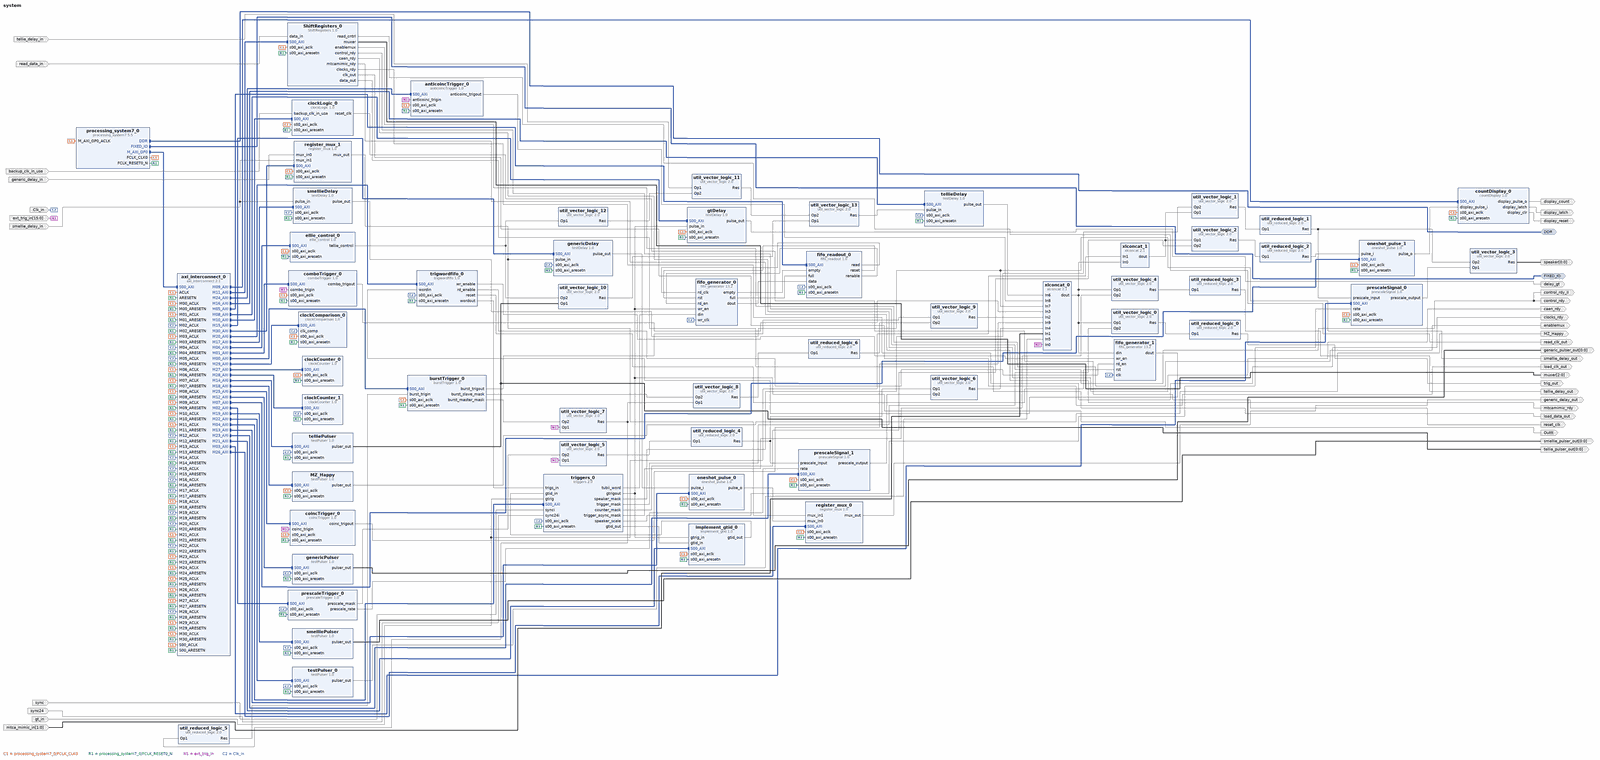
[diagram p0: block diagram of the top level, whole]
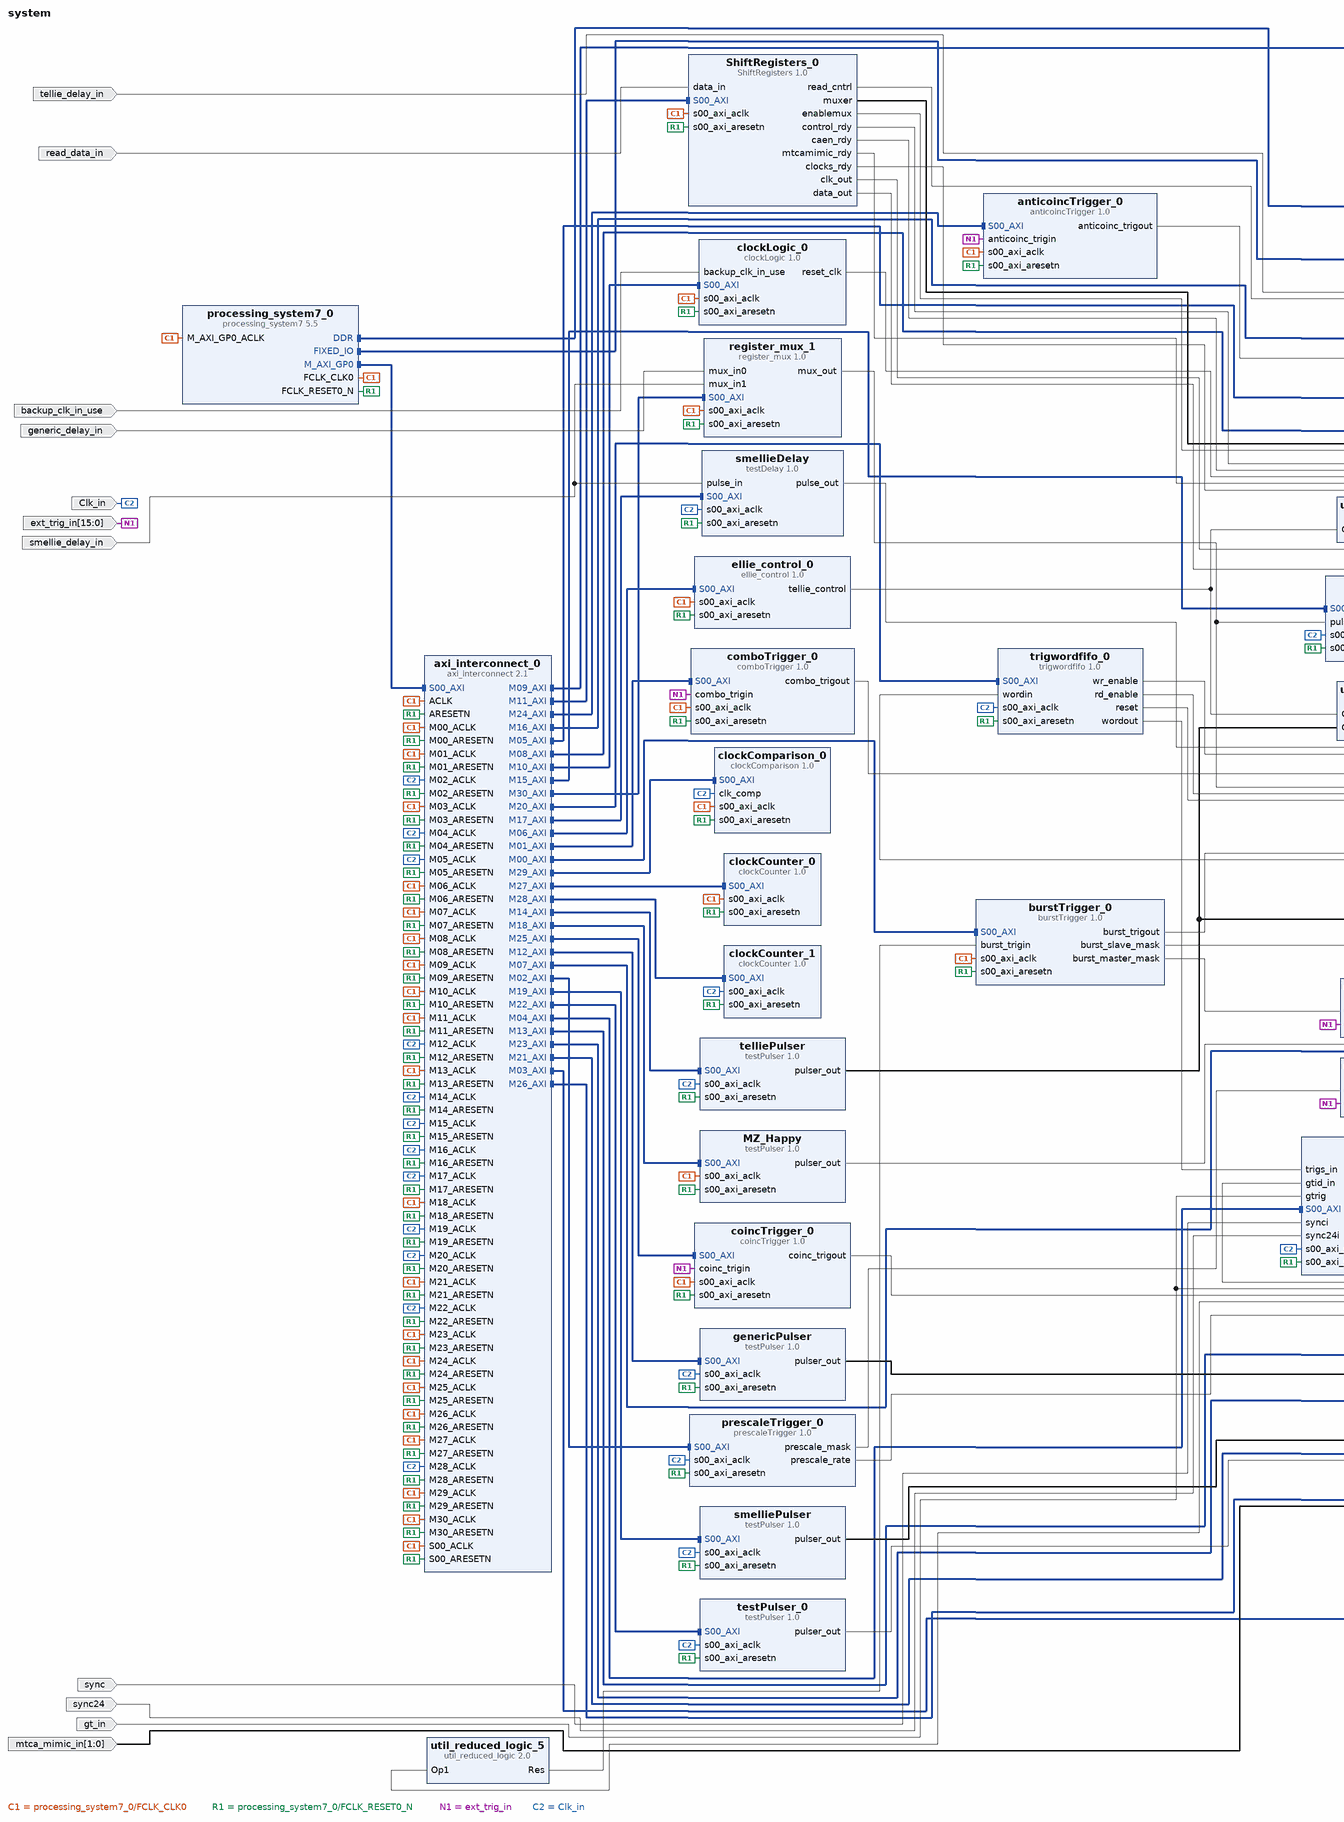
[diagram p1: block diagram of the top level, left part]
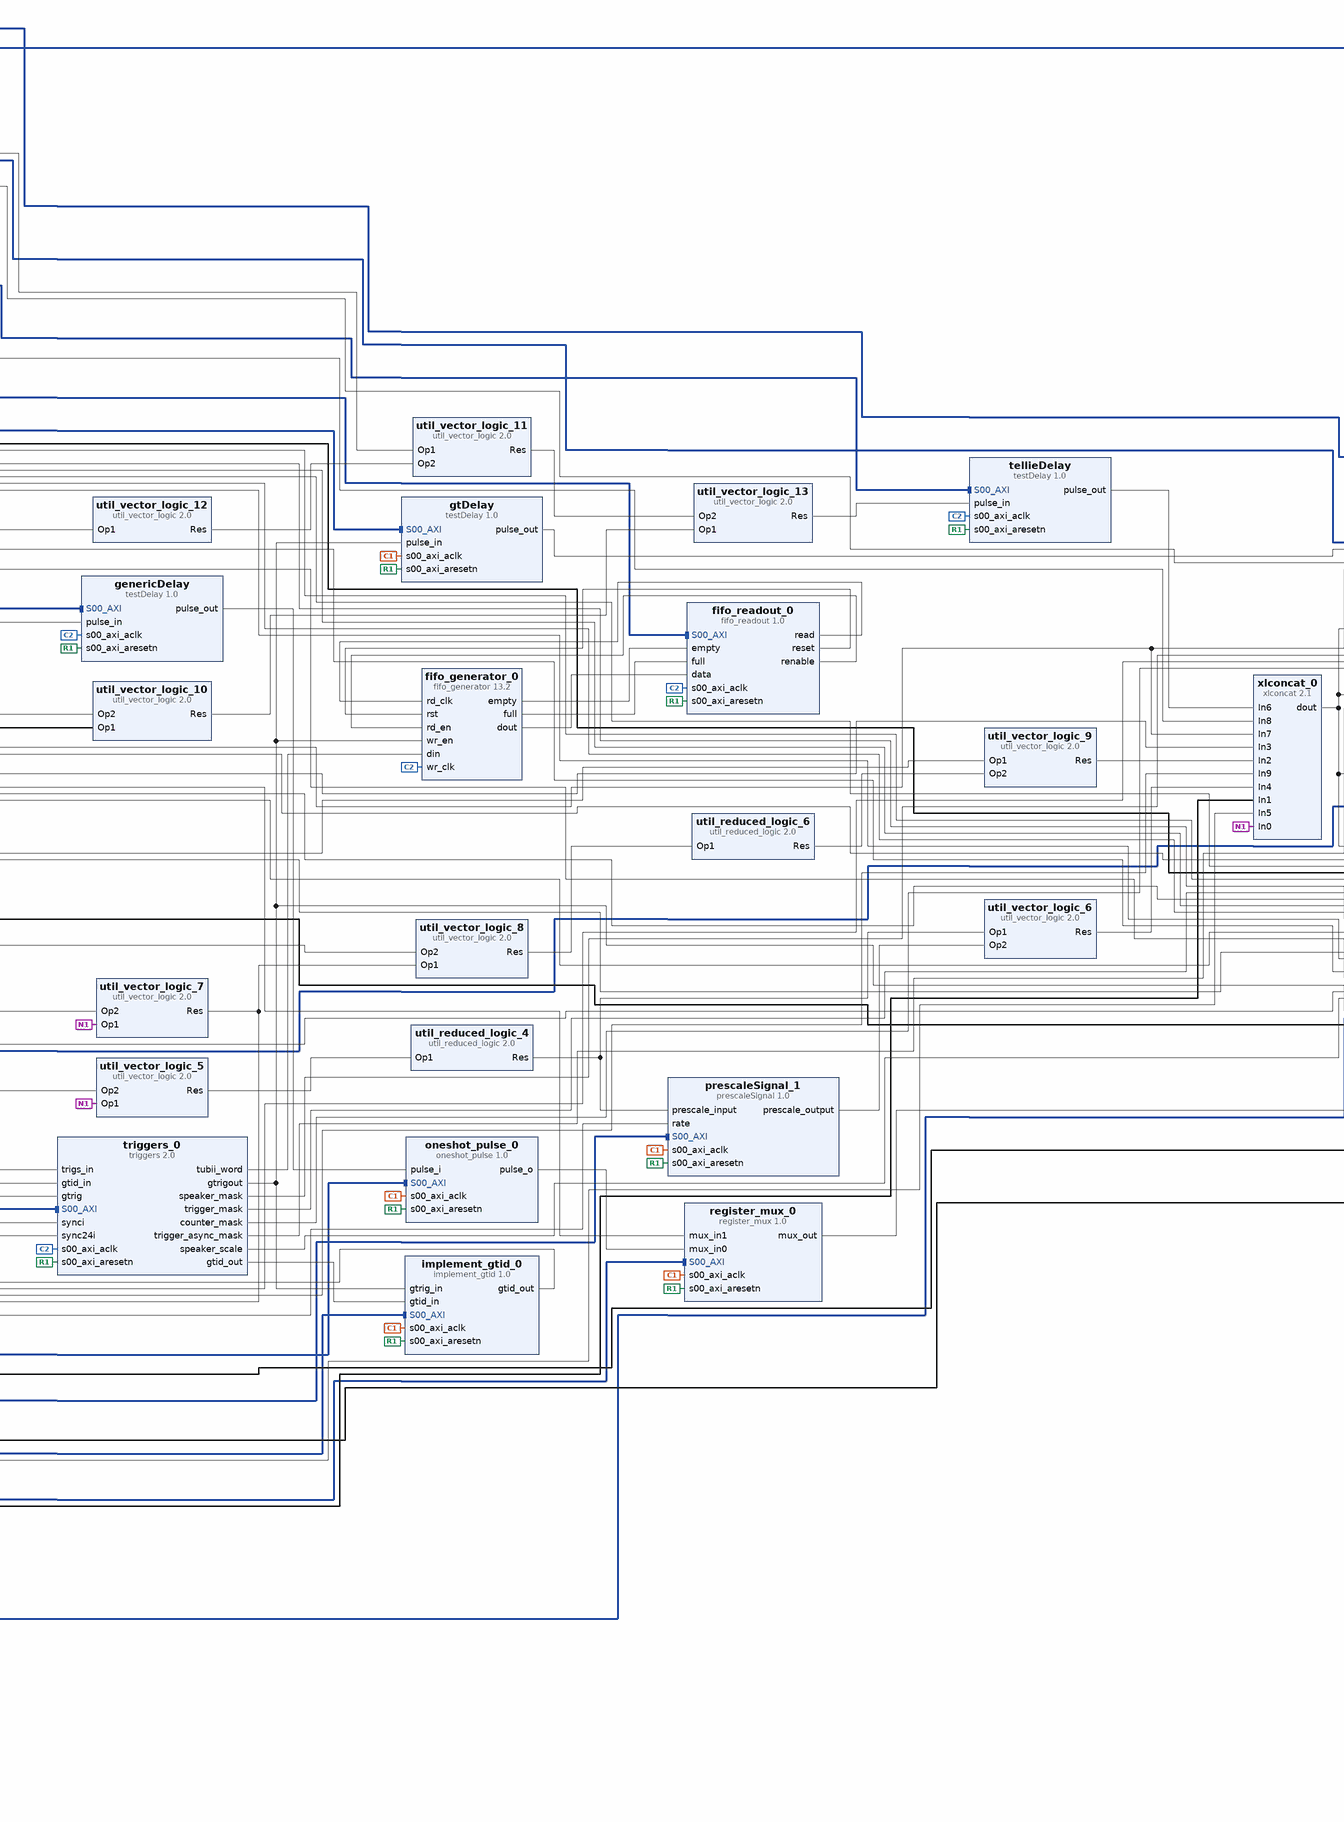
[diagram p2: block diagram of the top level, centre part]
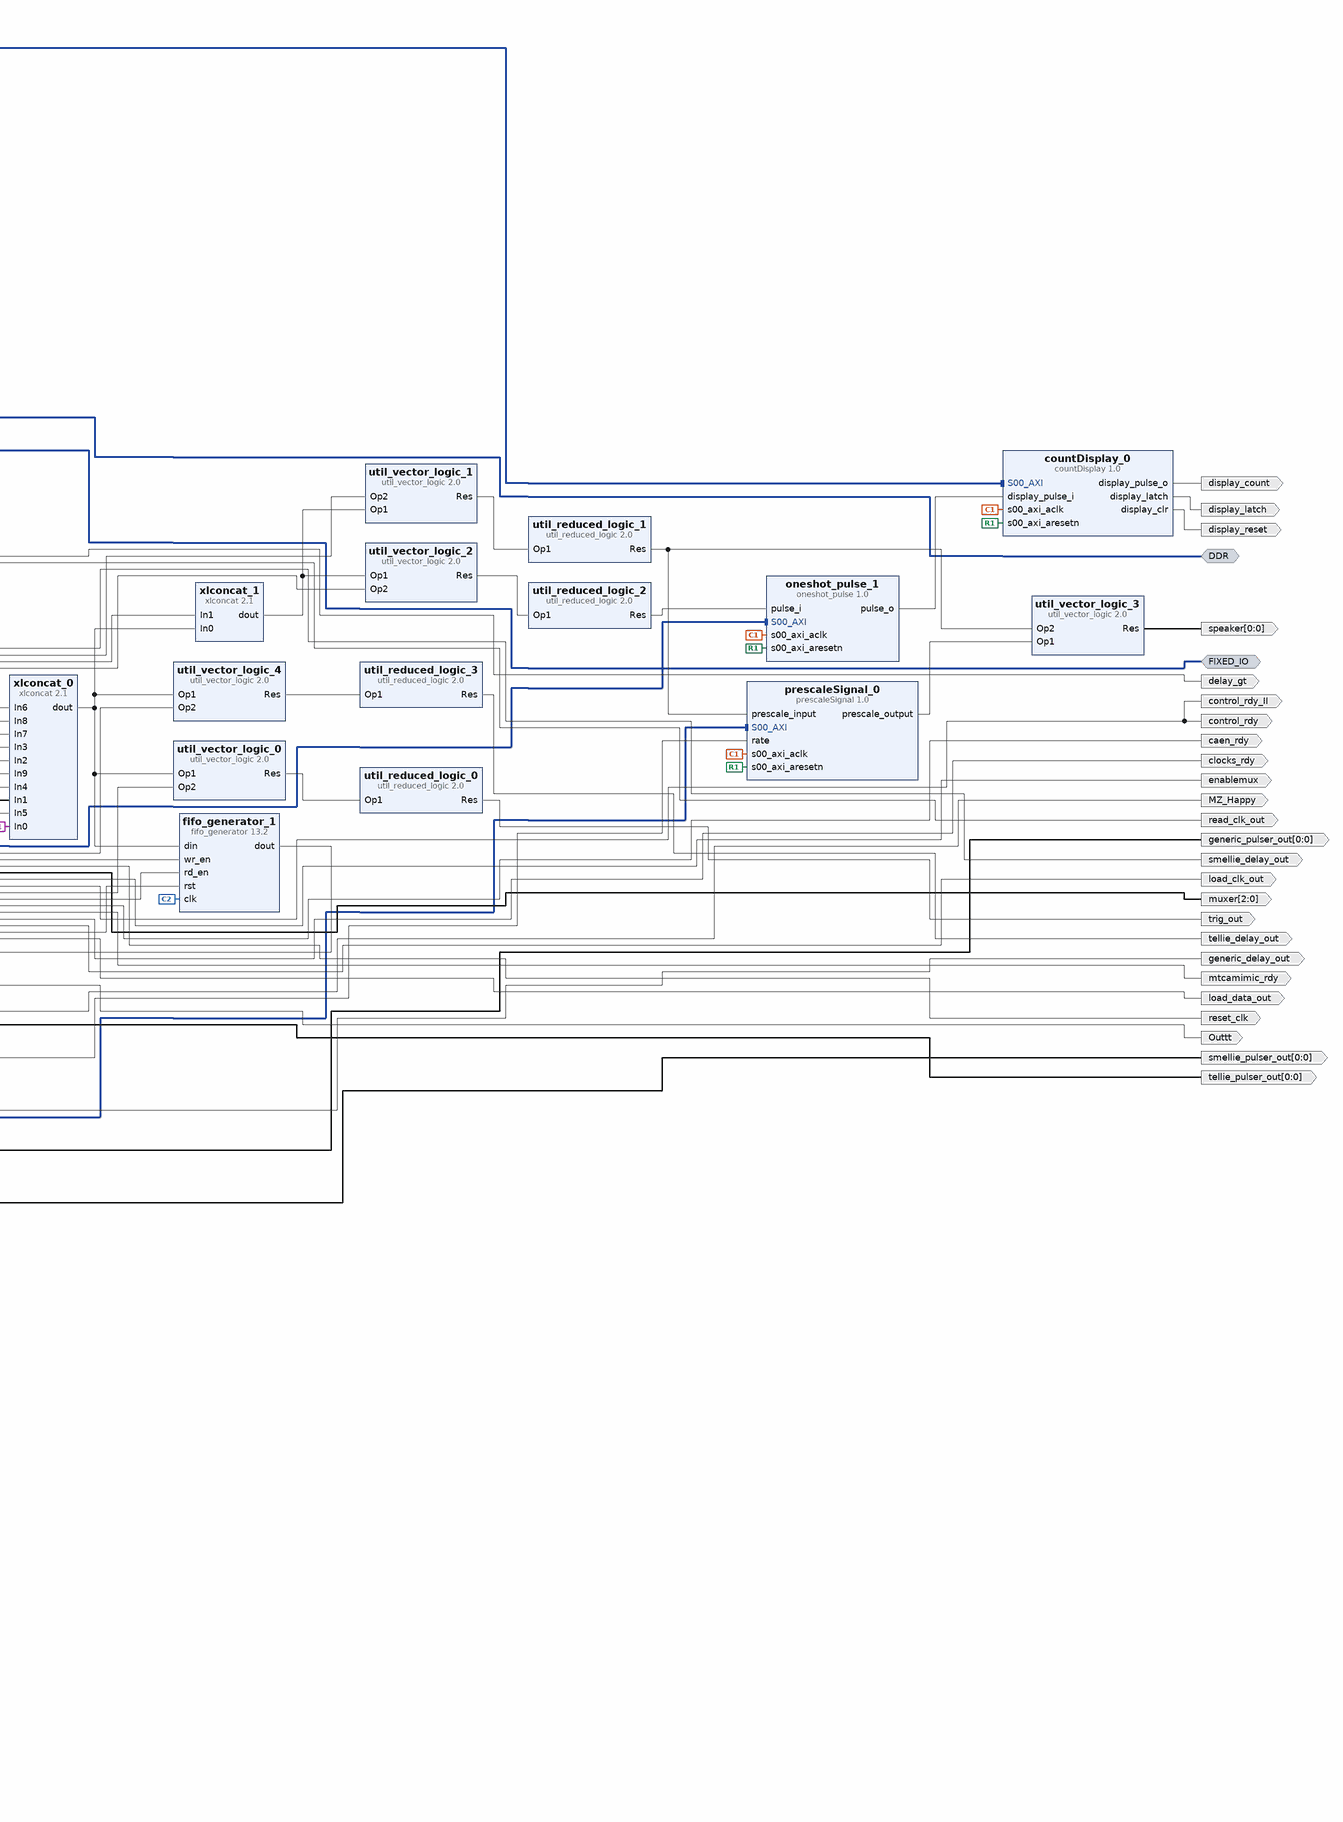
[diagram p3: block diagram of the top level, right part]
# Vivado block design system, xc7z020clg400-1, Vivado 2018.2
create_bd_design system

create_bd_intf_port -mode Master -vlnv xilinx.com:interface:ddrx_rtl:1.0 DDR
create_bd_intf_port -mode Master -vlnv xilinx.com:display_processing_system7:fixedio_rtl:1.0 FIXED_IO
create_bd_port -dir O trig_out
create_bd_port -dir O display_reset
create_bd_port -dir O display_latch
create_bd_port -dir O display_count
create_bd_port -dir I generic_delay_in
create_bd_port -dir I tellie_delay_in
create_bd_port -dir O smellie_delay_out
create_bd_port -dir I smellie_delay_in
create_bd_port -dir I sync
create_bd_port -dir I sync24
create_bd_port -dir I gt_in
create_bd_port -dir O read_clk_out
create_bd_port -dir I read_data_in
create_bd_port -dir O MZ_Happy
create_bd_port -dir O delay_gt
create_bd_port -dir I -from 1 -to 0 mtca_mimic_in
create_bd_port -dir I backup_clk_in_use
create_bd_port -dir O reset_clk
create_bd_port -dir I -from 15 -to 0 ext_trig_in
create_bd_port -dir O -from 2 -to 0 muxer
create_bd_port -dir O enablemux
create_bd_port -dir O control_rdy_II
create_bd_port -dir O control_rdy
create_bd_port -dir O caen_rdy
create_bd_port -dir O mtcamimic_rdy
create_bd_port -dir O clocks_rdy
create_bd_port -dir O load_clk_out
create_bd_port -dir O load_data_out
create_bd_port -dir O -from 0 -to 0 generic_pulser_out
create_bd_port -dir O -from 0 -to 0 tellie_pulser_out
create_bd_port -dir O -from 0 -to 0 smellie_pulser_out
create_bd_port -dir I -type clk Clk_in
set_property -dict {CONFIG.FREQ_HZ 100000000} [get_bd_ports Clk_in]
create_bd_port -dir O Outtt
create_bd_port -dir O -from 0 -to 0 speaker
create_bd_port -dir O tellie_delay_out
create_bd_port -dir O generic_delay_out

create_bd_cell -type ip -vlnv xilinx.com:user:countDisplay:1.0 countDisplay_0
create_bd_cell -type ip -vlnv xilinx.com:user:comboTrigger:1.0 comboTrigger_0
create_bd_cell -type ip -vlnv xilinx.com:user:prescaleTrigger:1.0 prescaleTrigger_0
create_bd_cell -type ip -vlnv xilinx.com:user:clockLogic:1.0 clockLogic_0
create_bd_cell -type ip -vlnv xilinx.com:user:ellie_control:1.0 ellie_control_0
create_bd_cell -type ip -vlnv xilinx.com:ip:axi_interconnect:2.1 axi_interconnect_0
set_property -dict {CONFIG.NUM_MI 31 CONFIG.SYNCHRONIZATION_STAGES 2} [get_bd_cells axi_interconnect_0]
create_bd_cell -type ip -vlnv xilinx.com:ip:fifo_generator:13.2 fifo_generator_0
set_property -dict [list \
  CONFIG.Fifo_Implementation Independent_Clocks_Block_RAM \
  CONFIG.Performance_Options Standard_FIFO \
  CONFIG.Input_Data_Width 50 \
  CONFIG.Input_Depth 65536 \
  CONFIG.Output_Data_Width 50 \
  CONFIG.Full_Flags_Reset_Value 1 \
] [get_bd_cells fifo_generator_0]
create_bd_cell -type ip -vlnv xilinx.com:ip:fifo_generator:13.2 fifo_generator_1
set_property -dict [list \
  CONFIG.Input_Data_Width 26 \
  CONFIG.Input_Depth 32768 \
  CONFIG.Output_Data_Width 26 \
  CONFIG.Reset_Type Asynchronous_Reset \
  CONFIG.Full_Flags_Reset_Value 1 \
] [get_bd_cells fifo_generator_1]
create_bd_cell -type ip -vlnv xilinx.com:ip:processing_system7:5.5 processing_system7_0
set_property -dict [list \
  CONFIG.PCW_UIPARAM_DDR_FREQ_MHZ 533.333333 \
  CONFIG.PCW_APU_PERIPHERAL_FREQMHZ 666.666666 \
  CONFIG.PCW_SDIO_PERIPHERAL_FREQMHZ 50 \
  CONFIG.PCW_UART_PERIPHERAL_FREQMHZ 100 \
  CONFIG.PCW_FPGA0_PERIPHERAL_FREQMHZ 100 \
  CONFIG.PCW_FPGA1_PERIPHERAL_FREQMHZ 50 \
  CONFIG.PCW_M_AXI_GP0_FREQMHZ 100 \
  CONFIG.PCW_GP0_EN_MODIFIABLE_TXN 0 \
  CONFIG.PCW_GP1_EN_MODIFIABLE_TXN 0 \
  CONFIG.PCW_PERIPHERAL_BOARD_PRESET microzed \
  CONFIG.PCW_PRESET_BANK1_VOLTAGE {LVCMOS 3.3V} \
  CONFIG.PCW_UIPARAM_DDR_PARTNO {MT41J128M8 JP-125} \
  CONFIG.PCW_QSPI_PERIPHERAL_ENABLE 1 \
  CONFIG.PCW_QSPI_QSPI_IO {MIO 1 .. 6} \
  CONFIG.PCW_QSPI_GRP_SINGLE_SS_ENABLE 1 \
  CONFIG.PCW_QSPI_GRP_SINGLE_SS_IO {MIO 1 .. 6} \
  CONFIG.PCW_SINGLE_QSPI_DATA_MODE x4 \
  CONFIG.PCW_ENET0_PERIPHERAL_ENABLE 1 \
  CONFIG.PCW_ENET0_ENET0_IO {MIO 16 .. 27} \
  CONFIG.PCW_ENET0_GRP_MDIO_ENABLE 0 \
  CONFIG.PCW_ENET_RESET_ENABLE 1 \
  CONFIG.PCW_ENET_RESET_SELECT {Share reset pin} \
  CONFIG.PCW_ENET0_RESET_ENABLE 0 \
  CONFIG.PCW_SD0_PERIPHERAL_ENABLE 1 \
  CONFIG.PCW_SD0_SD0_IO {MIO 40 .. 45} \
  CONFIG.PCW_SD0_GRP_CD_ENABLE 0 \
  CONFIG.PCW_SD0_GRP_WP_ENABLE 0 \
  CONFIG.PCW_UART1_PERIPHERAL_ENABLE 1 \
  CONFIG.PCW_UART1_UART1_IO {MIO 48 .. 49} \
  CONFIG.PCW_TRACE_INTERNAL_WIDTH 32 \
  CONFIG.PCW_USB0_PERIPHERAL_ENABLE 1 \
  CONFIG.PCW_USB0_USB0_IO {MIO 28 .. 39} \
  CONFIG.PCW_USB_RESET_ENABLE 1 \
  CONFIG.PCW_USB_RESET_SELECT {Share reset pin} \
  CONFIG.PCW_USB0_RESET_ENABLE 0 \
  CONFIG.PCW_I2C_RESET_ENABLE 1 \
  CONFIG.PCW_GPIO_MIO_GPIO_ENABLE 1 \
  CONFIG.PCW_GPIO_MIO_GPIO_IO MIO \
] [get_bd_cells processing_system7_0]
# 478 more settings of processing_system7_0 are not shown: defaults, MIO pin electricals, DDR timing, and values the tool derives
create_bd_cell -type ip -vlnv xilinx.com:ip:util_reduced_logic:2.0 util_reduced_logic_0
set_property -dict {CONFIG.C_SIZE 26 CONFIG.C_OPERATION or} [get_bd_cells util_reduced_logic_0]
create_bd_cell -type ip -vlnv xilinx.com:ip:util_reduced_logic:2.0 util_reduced_logic_1
set_property -dict {CONFIG.C_SIZE 27 CONFIG.C_OPERATION or} [get_bd_cells util_reduced_logic_1]
create_bd_cell -type ip -vlnv xilinx.com:ip:util_reduced_logic:2.0 util_reduced_logic_2
set_property -dict {CONFIG.C_SIZE 27 CONFIG.C_OPERATION or} [get_bd_cells util_reduced_logic_2]
create_bd_cell -type ip -vlnv xilinx.com:ip:util_reduced_logic:2.0 util_reduced_logic_3
set_property -dict {CONFIG.C_SIZE 26 CONFIG.C_OPERATION or} [get_bd_cells util_reduced_logic_3]
create_bd_cell -type ip -vlnv xilinx.com:ip:util_reduced_logic:2.0 util_reduced_logic_4
set_property -dict {CONFIG.C_SIZE 16 CONFIG.C_OPERATION or} [get_bd_cells util_reduced_logic_4]
create_bd_cell -type ip -vlnv xilinx.com:ip:util_reduced_logic:2.0 util_reduced_logic_5
set_property -dict {CONFIG.C_SIZE 16 CONFIG.C_OPERATION or} [get_bd_cells util_reduced_logic_5]
create_bd_cell -type ip -vlnv xilinx.com:ip:util_reduced_logic:2.0 util_reduced_logic_6
set_property -dict {CONFIG.C_SIZE 16 CONFIG.C_OPERATION or} [get_bd_cells util_reduced_logic_6]
create_bd_cell -type ip -vlnv xilinx.com:ip:util_vector_logic:2.0 util_vector_logic_0
set_property -dict {CONFIG.C_SIZE 26} [get_bd_cells util_vector_logic_0]
create_bd_cell -type ip -vlnv xilinx.com:ip:util_vector_logic:2.0 util_vector_logic_10
set_property -dict {CONFIG.C_SIZE 1} [get_bd_cells util_vector_logic_10]
create_bd_cell -type ip -vlnv xilinx.com:ip:util_vector_logic:2.0 util_vector_logic_11
set_property -dict {CONFIG.C_SIZE 1 CONFIG.C_OPERATION and} [get_bd_cells util_vector_logic_11]
create_bd_cell -type ip -vlnv xilinx.com:ip:util_vector_logic:2.0 util_vector_logic_12
set_property -dict {CONFIG.C_SIZE 1 CONFIG.C_OPERATION not} [get_bd_cells util_vector_logic_12]
create_bd_cell -type ip -vlnv xilinx.com:ip:util_vector_logic:2.0 util_vector_logic_13
set_property -dict {CONFIG.C_SIZE 1 CONFIG.C_OPERATION or} [get_bd_cells util_vector_logic_13]
create_bd_cell -type ip -vlnv xilinx.com:ip:util_vector_logic:2.0 util_vector_logic_1
set_property -dict {CONFIG.C_SIZE 27} [get_bd_cells util_vector_logic_1]
create_bd_cell -type ip -vlnv xilinx.com:ip:util_vector_logic:2.0 util_vector_logic_2
set_property -dict {CONFIG.C_SIZE 27} [get_bd_cells util_vector_logic_2]
create_bd_cell -type ip -vlnv xilinx.com:ip:util_vector_logic:2.0 util_vector_logic_3
set_property -dict {CONFIG.C_SIZE 1} [get_bd_cells util_vector_logic_3]
create_bd_cell -type ip -vlnv xilinx.com:ip:util_vector_logic:2.0 util_vector_logic_4
set_property -dict {CONFIG.C_SIZE 26} [get_bd_cells util_vector_logic_4]
create_bd_cell -type ip -vlnv xilinx.com:ip:util_vector_logic:2.0 util_vector_logic_5
set_property -dict {CONFIG.C_SIZE 16} [get_bd_cells util_vector_logic_5]
create_bd_cell -type ip -vlnv xilinx.com:ip:util_vector_logic:2.0 util_vector_logic_6
set_property -dict {CONFIG.C_SIZE 1} [get_bd_cells util_vector_logic_6]
create_bd_cell -type ip -vlnv xilinx.com:ip:util_vector_logic:2.0 util_vector_logic_7
set_property -dict {CONFIG.C_SIZE 16} [get_bd_cells util_vector_logic_7]
create_bd_cell -type ip -vlnv xilinx.com:ip:util_vector_logic:2.0 util_vector_logic_8
set_property -dict {CONFIG.C_SIZE 16} [get_bd_cells util_vector_logic_8]
create_bd_cell -type ip -vlnv xilinx.com:ip:util_vector_logic:2.0 util_vector_logic_9
set_property -dict {CONFIG.C_SIZE 1} [get_bd_cells util_vector_logic_9]
create_bd_cell -type ip -vlnv xilinx.com:ip:xlconcat:2.1 xlconcat_0
set_property -dict {CONFIG.NUM_PORTS 10 CONFIG.IN0_WIDTH 16 CONFIG.IN1_WIDTH 2 CONFIG.dout_width 26} [get_bd_cells xlconcat_0]
create_bd_cell -type ip -vlnv xilinx.com:ip:xlconcat:2.1 xlconcat_1
set_property -dict {CONFIG.IN0_WIDTH 26 CONFIG.IN1_WIDTH 1 CONFIG.dout_width 27} [get_bd_cells xlconcat_1]
create_bd_cell -type ip -vlnv user.org:user:anticoincTrigger:1.0 anticoincTrigger_0
create_bd_cell -type ip -vlnv user.org:user:coincTrigger:1.0 coincTrigger_0
create_bd_cell -type ip -vlnv xilinx.com:user:fifo_readout:1.0 fifo_readout_0
create_bd_cell -type ip -vlnv xilinx.com:user:prescaleSignal:1.0 prescaleSignal_0
create_bd_cell -type ip -vlnv xilinx.com:user:prescaleSignal:1.0 prescaleSignal_1
create_bd_cell -type ip -vlnv user.org:user:register_mux:1.0 register_mux_0
create_bd_cell -type ip -vlnv xilinx.com:user:ShiftRegisters:1.0 ShiftRegisters_0
create_bd_cell -type ip -vlnv xilinx.com:user:implement_gtid:1.0 implement_gtid_0
create_bd_cell -type ip -vlnv xilinx.com:user:testDelay:1.0 genericDelay
create_bd_cell -type ip -vlnv xilinx.com:user:testDelay:1.0 gtDelay
create_bd_cell -type ip -vlnv xilinx.com:user:testDelay:1.0 tellieDelay
create_bd_cell -type ip -vlnv xilinx.com:user:testDelay:1.0 smellieDelay
create_bd_cell -type ip -vlnv xilinx.com:user:burstTrigger:1.0 burstTrigger_0
create_bd_cell -type ip -vlnv xilinx.com:user:oneshot_pulse:1.0 oneshot_pulse_0
create_bd_cell -type ip -vlnv xilinx.com:user:oneshot_pulse:1.0 oneshot_pulse_1
create_bd_cell -type ip -vlnv xilinx.com:user:testPulser:1.0 telliePulser
create_bd_cell -type ip -vlnv xilinx.com:user:testPulser:1.0 testPulser_0
create_bd_cell -type ip -vlnv xilinx.com:user:testPulser:1.0 MZ_Happy
create_bd_cell -type ip -vlnv xilinx.com:user:testPulser:1.0 genericPulser
create_bd_cell -type ip -vlnv xilinx.com:user:testPulser:1.0 smelliePulser
create_bd_cell -type ip -vlnv xilinx.com:user:trigwordfifo:1.0 trigwordfifo_0
create_bd_cell -type ip -vlnv user.org:user:clockCounter:1.0 clockCounter_0
create_bd_cell -type ip -vlnv user.org:user:clockCounter:1.0 clockCounter_1
create_bd_cell -type ip -vlnv user.org:user:clockComparison:1.0 clockComparison_0
create_bd_cell -type ip -vlnv user.org:user:register_mux:1.0 register_mux_1
create_bd_cell -type ip -vlnv xilinx.com:user:triggers:2.0 triggers_0

# ---- connections ----

connect_bd_intf_net [get_bd_intf_pins processing_system7_0/M_AXI_GP0] [get_bd_intf_pins axi_interconnect_0/S00_AXI]
connect_bd_intf_net [get_bd_intf_pins axi_interconnect_0/M00_AXI] [get_bd_intf_pins burstTrigger_0/S00_AXI]
connect_bd_intf_net [get_bd_intf_pins prescaleTrigger_0/S00_AXI] [get_bd_intf_pins axi_interconnect_0/M02_AXI]
connect_bd_intf_net [get_bd_intf_pins axi_interconnect_0/M08_AXI] [get_bd_intf_pins gtDelay/S00_AXI]
connect_bd_intf_net [get_bd_intf_pins countDisplay_0/S00_AXI] [get_bd_intf_pins axi_interconnect_0/M09_AXI]
connect_bd_intf_net [get_bd_intf_pins axi_interconnect_0/M10_AXI] [get_bd_intf_pins clockLogic_0/S00_AXI]
connect_bd_intf_net [get_bd_intf_pins axi_interconnect_0/M16_AXI] [get_bd_intf_pins tellieDelay/S00_AXI]
connect_bd_intf_net [get_bd_intf_pins axi_interconnect_0/M15_AXI] [get_bd_intf_pins genericDelay/S00_AXI]
connect_bd_intf_net [get_bd_intf_pins axi_interconnect_0/M17_AXI] [get_bd_intf_pins smellieDelay/S00_AXI]
connect_bd_intf_net [get_bd_intf_pins axi_interconnect_0/M18_AXI] [get_bd_intf_pins MZ_Happy/S00_AXI]
connect_bd_intf_net [get_bd_intf_pins axi_interconnect_0/M01_AXI] [get_bd_intf_pins comboTrigger_0/S00_AXI]
connect_bd_intf_net [get_bd_intf_pins genericPulser/S00_AXI] [get_bd_intf_pins axi_interconnect_0/M12_AXI]
connect_bd_intf_net [get_bd_intf_pins telliePulser/S00_AXI] [get_bd_intf_pins axi_interconnect_0/M14_AXI]
connect_bd_intf_net [get_bd_intf_pins smelliePulser/S00_AXI] [get_bd_intf_pins axi_interconnect_0/M19_AXI]
connect_bd_intf_net [get_bd_intf_pins fifo_readout_0/S00_AXI] [get_bd_intf_pins axi_interconnect_0/M05_AXI]
connect_bd_intf_net [get_bd_intf_pins oneshot_pulse_1/S00_AXI] [get_bd_intf_pins axi_interconnect_0/M07_AXI]
connect_bd_intf_net [get_bd_intf_pins oneshot_pulse_0/S00_AXI] [get_bd_intf_pins axi_interconnect_0/M13_AXI]
connect_bd_intf_net [get_bd_intf_pins ShiftRegisters_0/S00_AXI] [get_bd_intf_pins axi_interconnect_0/M11_AXI]
connect_bd_intf_net [get_bd_intf_pins triggers_0/S00_AXI] [get_bd_intf_pins axi_interconnect_0/M04_AXI]
connect_bd_intf_net [get_bd_intf_pins axi_interconnect_0/M21_AXI] [get_bd_intf_pins implement_gtid_0/S00_AXI]
connect_bd_intf_net [get_bd_intf_pins prescaleSignal_0/S00_AXI] [get_bd_intf_pins axi_interconnect_0/M03_AXI]
connect_bd_intf_net [get_bd_intf_pins axi_interconnect_0/M23_AXI] [get_bd_intf_pins prescaleSignal_1/S00_AXI]
connect_bd_intf_net [get_bd_intf_pins testPulser_0/S00_AXI] [get_bd_intf_pins axi_interconnect_0/M22_AXI]
connect_bd_intf_net [get_bd_intf_pins axi_interconnect_0/M20_AXI] [get_bd_intf_pins trigwordfifo_0/S00_AXI]
connect_bd_intf_net [get_bd_intf_pins ellie_control_0/S00_AXI] [get_bd_intf_pins axi_interconnect_0/M06_AXI]
connect_bd_intf_net [get_bd_intf_pins anticoincTrigger_0/S00_AXI] [get_bd_intf_pins axi_interconnect_0/M24_AXI]
connect_bd_intf_net [get_bd_intf_pins axi_interconnect_0/M25_AXI] [get_bd_intf_pins coincTrigger_0/S00_AXI]
connect_bd_intf_net [get_bd_intf_pins axi_interconnect_0/M26_AXI] [get_bd_intf_pins register_mux_0/S00_AXI]
connect_bd_intf_net [get_bd_intf_pins clockCounter_0/S00_AXI] [get_bd_intf_pins axi_interconnect_0/M27_AXI]
connect_bd_intf_net [get_bd_intf_pins clockCounter_1/S00_AXI] [get_bd_intf_pins axi_interconnect_0/M28_AXI]
connect_bd_intf_net [get_bd_intf_pins axi_interconnect_0/M29_AXI] [get_bd_intf_pins clockComparison_0/S00_AXI]
connect_bd_intf_net [get_bd_intf_pins axi_interconnect_0/M30_AXI] [get_bd_intf_pins register_mux_1/S00_AXI]
connect_bd_intf_net [get_bd_intf_ports DDR] [get_bd_intf_pins processing_system7_0/DDR]
connect_bd_intf_net [get_bd_intf_ports FIXED_IO] [get_bd_intf_pins processing_system7_0/FIXED_IO]
connect_bd_net [get_bd_pins processing_system7_0/FCLK_CLK0] \
  [get_bd_pins countDisplay_0/s00_axi_aclk] [get_bd_pins comboTrigger_0/s00_axi_aclk] [get_bd_pins clockLogic_0/s00_axi_aclk] \
  [get_bd_pins ellie_control_0/s00_axi_aclk] [get_bd_pins processing_system7_0/M_AXI_GP0_ACLK] \
  [get_bd_pins anticoincTrigger_0/s00_axi_aclk] [get_bd_pins coincTrigger_0/s00_axi_aclk] \
  [get_bd_pins prescaleSignal_0/s00_axi_aclk] [get_bd_pins prescaleSignal_1/s00_axi_aclk] \
  [get_bd_pins register_mux_0/s00_axi_aclk] [get_bd_pins ShiftRegisters_0/s00_axi_aclk] \
  [get_bd_pins implement_gtid_0/s00_axi_aclk] [get_bd_pins gtDelay/s00_axi_aclk] [get_bd_pins burstTrigger_0/s00_axi_aclk] \
  [get_bd_pins oneshot_pulse_0/s00_axi_aclk] [get_bd_pins oneshot_pulse_1/s00_axi_aclk] [get_bd_pins MZ_Happy/s00_axi_aclk] \
  [get_bd_pins clockCounter_0/s00_axi_aclk] [get_bd_pins clockComparison_0/s00_axi_aclk] \
  [get_bd_pins register_mux_1/s00_axi_aclk] [get_bd_pins axi_interconnect_0/ACLK] [get_bd_pins axi_interconnect_0/S00_ACLK] \
  [get_bd_pins axi_interconnect_0/M00_ACLK] [get_bd_pins axi_interconnect_0/M01_ACLK] \
  [get_bd_pins axi_interconnect_0/M06_ACLK] [get_bd_pins axi_interconnect_0/M07_ACLK] \
  [get_bd_pins axi_interconnect_0/M08_ACLK] [get_bd_pins axi_interconnect_0/M09_ACLK] \
  [get_bd_pins axi_interconnect_0/M10_ACLK] [get_bd_pins axi_interconnect_0/M11_ACLK] \
  [get_bd_pins axi_interconnect_0/M13_ACLK] [get_bd_pins axi_interconnect_0/M18_ACLK] \
  [get_bd_pins axi_interconnect_0/M24_ACLK] [get_bd_pins axi_interconnect_0/M25_ACLK] \
  [get_bd_pins axi_interconnect_0/M03_ACLK] [get_bd_pins axi_interconnect_0/M23_ACLK] \
  [get_bd_pins axi_interconnect_0/M21_ACLK] [get_bd_pins axi_interconnect_0/M26_ACLK] \
  [get_bd_pins axi_interconnect_0/M27_ACLK] [get_bd_pins axi_interconnect_0/M29_ACLK] \
  [get_bd_pins axi_interconnect_0/M30_ACLK]
connect_bd_net -net M00_ARESETN_1 [get_bd_pins processing_system7_0/FCLK_RESET0_N] \
  [get_bd_pins countDisplay_0/s00_axi_aresetn] [get_bd_pins comboTrigger_0/s00_axi_aresetn] \
  [get_bd_pins prescaleTrigger_0/s00_axi_aresetn] [get_bd_pins clockLogic_0/s00_axi_aresetn] \
  [get_bd_pins ellie_control_0/s00_axi_aresetn] [get_bd_pins anticoincTrigger_0/s00_axi_aresetn] \
  [get_bd_pins coincTrigger_0/s00_axi_aresetn] [get_bd_pins fifo_readout_0/s00_axi_aresetn] \
  [get_bd_pins prescaleSignal_0/s00_axi_aresetn] [get_bd_pins prescaleSignal_1/s00_axi_aresetn] \
  [get_bd_pins register_mux_0/s00_axi_aresetn] [get_bd_pins ShiftRegisters_0/s00_axi_aresetn] \
  [get_bd_pins implement_gtid_0/s00_axi_aresetn] [get_bd_pins genericDelay/s00_axi_aresetn] \
  [get_bd_pins gtDelay/s00_axi_aresetn] [get_bd_pins tellieDelay/s00_axi_aresetn] [get_bd_pins smellieDelay/s00_axi_aresetn] \
  [get_bd_pins burstTrigger_0/s00_axi_aresetn] [get_bd_pins oneshot_pulse_0/s00_axi_aresetn] \
  [get_bd_pins oneshot_pulse_1/s00_axi_aresetn] [get_bd_pins telliePulser/s00_axi_aresetn] \
  [get_bd_pins testPulser_0/s00_axi_aresetn] [get_bd_pins MZ_Happy/s00_axi_aresetn] \
  [get_bd_pins genericPulser/s00_axi_aresetn] [get_bd_pins smelliePulser/s00_axi_aresetn] \
  [get_bd_pins trigwordfifo_0/s00_axi_aresetn] [get_bd_pins clockCounter_0/s00_axi_aresetn] \
  [get_bd_pins clockCounter_1/s00_axi_aresetn] [get_bd_pins clockComparison_0/s00_axi_aresetn] \
  [get_bd_pins register_mux_1/s00_axi_aresetn] [get_bd_pins axi_interconnect_0/ARESETN] \
  [get_bd_pins axi_interconnect_0/S00_ARESETN] [get_bd_pins axi_interconnect_0/M00_ARESETN] \
  [get_bd_pins axi_interconnect_0/M01_ARESETN] [get_bd_pins axi_interconnect_0/M02_ARESETN] \
  [get_bd_pins axi_interconnect_0/M03_ARESETN] [get_bd_pins axi_interconnect_0/M04_ARESETN] \
  [get_bd_pins axi_interconnect_0/M05_ARESETN] [get_bd_pins axi_interconnect_0/M06_ARESETN] \
  [get_bd_pins axi_interconnect_0/M07_ARESETN] [get_bd_pins axi_interconnect_0/M08_ARESETN] \
  [get_bd_pins axi_interconnect_0/M09_ARESETN] [get_bd_pins axi_interconnect_0/M10_ARESETN] \
  [get_bd_pins axi_interconnect_0/M11_ARESETN] [get_bd_pins axi_interconnect_0/M12_ARESETN] \
  [get_bd_pins axi_interconnect_0/M13_ARESETN] [get_bd_pins axi_interconnect_0/M14_ARESETN] \
  [get_bd_pins axi_interconnect_0/M15_ARESETN] [get_bd_pins axi_interconnect_0/M16_ARESETN] \
  [get_bd_pins axi_interconnect_0/M17_ARESETN] [get_bd_pins axi_interconnect_0/M18_ARESETN] \
  [get_bd_pins axi_interconnect_0/M19_ARESETN] [get_bd_pins axi_interconnect_0/M20_ARESETN] \
  [get_bd_pins axi_interconnect_0/M21_ARESETN] [get_bd_pins axi_interconnect_0/M22_ARESETN] \
  [get_bd_pins axi_interconnect_0/M23_ARESETN] [get_bd_pins axi_interconnect_0/M24_ARESETN] \
  [get_bd_pins axi_interconnect_0/M25_ARESETN] [get_bd_pins axi_interconnect_0/M26_ARESETN] \
  [get_bd_pins axi_interconnect_0/M27_ARESETN] [get_bd_pins axi_interconnect_0/M28_ARESETN] \
  [get_bd_pins axi_interconnect_0/M29_ARESETN] [get_bd_pins axi_interconnect_0/M30_ARESETN] \
  [get_bd_pins triggers_0/s00_axi_aresetn]
connect_bd_net -net triggerOut_0_trig_out [get_bd_pins util_reduced_logic_0/Res] [get_bd_ports trig_out]
connect_bd_net [get_bd_pins countDisplay_0/display_clr] [get_bd_ports display_reset]
connect_bd_net [get_bd_pins countDisplay_0/display_latch] [get_bd_ports display_latch]
connect_bd_net [get_bd_pins countDisplay_0/display_pulse_o] [get_bd_ports display_count]
connect_bd_net -net testDelay_0_s00_axi_userout [get_bd_pins genericDelay/pulse_out] [get_bd_pins oneshot_pulse_0/pulse_i]
connect_bd_net -net s00_axi_userin_1 [get_bd_ports generic_delay_in] [get_bd_pins register_mux_1/mux_in0]
connect_bd_net -net s00_axi_userin_2_1 [get_bd_ports tellie_delay_in] [get_bd_pins util_vector_logic_11/Op1]
connect_bd_net -net testDelay_2_s00_axi_userout [get_bd_pins tellieDelay/pulse_out] [get_bd_pins xlconcat_0/In6]
connect_bd_net -net testDelay_3_s00_axi_userout [get_bd_pins smellieDelay/pulse_out] [get_bd_ports smellie_delay_out] [get_bd_pins xlconcat_0/In7]
connect_bd_net -net s00_axi_userin_3_1 [get_bd_ports smellie_delay_in] [get_bd_pins smellieDelay/pulse_in] [get_bd_pins register_mux_1/mux_in1]
connect_bd_net [get_bd_ports sync] [get_bd_pins triggers_0/synci]
connect_bd_net -net sync24_1 [get_bd_ports sync24] [get_bd_pins triggers_0/sync24i]
connect_bd_net -net prescaleTrigger_0_s00_axi_trigout [get_bd_pins util_vector_logic_6/Res] [get_bd_pins xlconcat_0/In4]
connect_bd_net -net comboTrigger_0_s00_axi_trigout [get_bd_pins comboTrigger_0/combo_trigout] [get_bd_pins xlconcat_0/In3]
connect_bd_net [get_bd_ports gt_in] [get_bd_pins xlconcat_1/In1] [get_bd_pins triggers_0/gtrig]
connect_bd_net -net readShift_0_clk_out [get_bd_pins ShiftRegisters_0/read_cntrl] [get_bd_ports read_clk_out]
connect_bd_net -net data_in_1 [get_bd_ports read_data_in] [get_bd_pins ShiftRegisters_0/data_in]
connect_bd_net [get_bd_pins MZ_Happy/pulser_out] [get_bd_ports MZ_Happy]
connect_bd_net -net testDelay_0_s00_axi_userout1 [get_bd_pins gtDelay/pulse_out] [get_bd_ports delay_gt]
connect_bd_net [get_bd_ports mtca_mimic_in] [get_bd_pins xlconcat_0/In1]
connect_bd_net [get_bd_ports backup_clk_in_use] [get_bd_pins clockLogic_0/backup_clk_in_use]
connect_bd_net [get_bd_pins clockLogic_0/reset_clk] [get_bd_ports reset_clk]
connect_bd_net -net burstTrigger_0_s00_axi_trigout1 [get_bd_pins burstTrigger_0/burst_trigout] [get_bd_pins util_vector_logic_9/Op1]
connect_bd_net [get_bd_ports ext_trig_in] \
  [get_bd_pins comboTrigger_0/combo_trigin] [get_bd_pins util_vector_logic_5/Op1] [get_bd_pins util_vector_logic_7/Op1] \
  [get_bd_pins xlconcat_0/In0] [get_bd_pins anticoincTrigger_0/anticoinc_trigin] [get_bd_pins coincTrigger_0/coinc_trigin]
connect_bd_net -net ShiftRegs_0_muxer [get_bd_pins ShiftRegisters_0/muxer] [get_bd_ports muxer]
connect_bd_net -net ShiftRegs_0_enablemux [get_bd_pins ShiftRegisters_0/enablemux] [get_bd_ports enablemux]
connect_bd_net -net ShiftRegs_0_control_rdy [get_bd_pins ShiftRegisters_0/control_rdy] [get_bd_ports control_rdy] [get_bd_ports control_rdy_II]
connect_bd_net -net ShiftRegs_0_caen_rdy [get_bd_pins ShiftRegisters_0/caen_rdy] [get_bd_ports caen_rdy]
connect_bd_net -net ShiftRegs_0_mtcamimic_rdy [get_bd_pins ShiftRegisters_0/mtcamimic_rdy] [get_bd_ports mtcamimic_rdy]
connect_bd_net -net ShiftRegs_0_clocks_rdy [get_bd_pins ShiftRegisters_0/clocks_rdy] [get_bd_ports clocks_rdy]
connect_bd_net -net ShiftRegs_0_clk_out [get_bd_pins ShiftRegisters_0/clk_out] [get_bd_ports load_clk_out]
connect_bd_net -net ShiftRegs_0_data_out [get_bd_pins ShiftRegisters_0/data_out] [get_bd_ports load_data_out]
connect_bd_net -net testPulser_0_pulser_out [get_bd_pins genericPulser/pulser_out] [get_bd_ports generic_pulser_out]
connect_bd_net -net testPulser_0_pulser_out1 [get_bd_pins telliePulser/pulser_out] \
  [get_bd_ports tellie_pulser_out] [get_bd_pins util_vector_logic_10/Op1]
connect_bd_net -net testPulser_1_pulser_out [get_bd_pins smelliePulser/pulser_out] [get_bd_ports smellie_pulser_out]
connect_bd_net [get_bd_ports Clk_in] \
  [get_bd_pins prescaleTrigger_0/s00_axi_aclk] [get_bd_pins fifo_generator_0/wr_clk] [get_bd_pins fifo_generator_1/clk] \
  [get_bd_pins fifo_readout_0/s00_axi_aclk] [get_bd_pins genericDelay/s00_axi_aclk] [get_bd_pins smellieDelay/s00_axi_aclk] \
  [get_bd_pins testPulser_0/s00_axi_aclk] [get_bd_pins genericPulser/s00_axi_aclk] [get_bd_pins smelliePulser/s00_axi_aclk] \
  [get_bd_pins trigwordfifo_0/s00_axi_aclk] [get_bd_pins clockCounter_1/s00_axi_aclk] \
  [get_bd_pins clockComparison_0/clk_comp] [get_bd_pins tellieDelay/s00_axi_aclk] [get_bd_pins telliePulser/s00_axi_aclk] \
  [get_bd_pins axi_interconnect_0/M02_ACLK] [get_bd_pins axi_interconnect_0/M04_ACLK] \
  [get_bd_pins axi_interconnect_0/M05_ACLK] [get_bd_pins axi_interconnect_0/M12_ACLK] \
  [get_bd_pins axi_interconnect_0/M15_ACLK] [get_bd_pins axi_interconnect_0/M17_ACLK] \
  [get_bd_pins axi_interconnect_0/M19_ACLK] [get_bd_pins axi_interconnect_0/M20_ACLK] \
  [get_bd_pins axi_interconnect_0/M22_ACLK] [get_bd_pins axi_interconnect_0/M28_ACLK] \
  [get_bd_pins axi_interconnect_0/M14_ACLK] [get_bd_pins axi_interconnect_0/M16_ACLK] [get_bd_pins triggers_0/s00_axi_aclk]
connect_bd_net -net triggerOut_0_counter [get_bd_pins util_reduced_logic_2/Res] [get_bd_pins oneshot_pulse_1/pulse_i]
connect_bd_net [get_bd_pins fifo_readout_0/read] [get_bd_pins fifo_generator_0/rd_clk]
connect_bd_net [get_bd_pins fifo_generator_0/empty] [get_bd_pins fifo_readout_0/empty]
connect_bd_net [get_bd_pins fifo_generator_0/full] [get_bd_pins fifo_readout_0/full]
connect_bd_net [get_bd_pins fifo_generator_0/dout] [get_bd_pins fifo_readout_0/data]
connect_bd_net [get_bd_pins fifo_readout_0/reset] [get_bd_pins fifo_generator_0/rst]
connect_bd_net -net triggerOut_0_gtrigout [get_bd_pins triggers_0/gtrigout] \
  [get_bd_ports Outtt] [get_bd_pins fifo_generator_0/wr_en] [get_bd_pins implement_gtid_0/gtrig_in] \
  [get_bd_pins gtDelay/pulse_in]
connect_bd_net [get_bd_pins oneshot_pulse_1/pulse_o] [get_bd_pins countDisplay_0/display_pulse_i]
connect_bd_net [get_bd_pins oneshot_pulse_0/pulse_o] [get_bd_pins register_mux_0/mux_in0]
connect_bd_net -net triggerOut_0_tubii_word [get_bd_pins triggers_0/tubii_word] [get_bd_pins fifo_generator_0/din]
connect_bd_net [get_bd_pins fifo_readout_0/renable] [get_bd_pins fifo_generator_0/rd_en]
connect_bd_net -net triggers_0_speaker [get_bd_pins util_reduced_logic_1/Res] \
  [get_bd_pins util_vector_logic_3/Op2] [get_bd_pins prescaleSignal_0/prescale_input]
connect_bd_net [get_bd_pins triggers_0/gtid_out] [get_bd_pins implement_gtid_0/gtid_in]
connect_bd_net -net implement_gtid_0_gtid [get_bd_pins implement_gtid_0/gtid_out] [get_bd_pins triggers_0/gtid_in]
connect_bd_net [get_bd_pins xlconcat_0/dout] \
  [get_bd_pins fifo_generator_1/din] [get_bd_pins util_vector_logic_0/Op1] [get_bd_pins util_vector_logic_4/Op1] \
  [get_bd_pins xlconcat_1/In0]
connect_bd_net [get_bd_pins triggers_0/trigger_mask] [get_bd_pins util_vector_logic_0/Op2]
connect_bd_net [get_bd_pins util_vector_logic_0/Res] [get_bd_pins util_reduced_logic_0/Op1]
connect_bd_net [get_bd_pins xlconcat_1/dout] [get_bd_pins util_vector_logic_1/Op1] [get_bd_pins util_vector_logic_2/Op1]
connect_bd_net [get_bd_pins triggers_0/speaker_mask] [get_bd_pins util_vector_logic_1/Op2]
connect_bd_net [get_bd_pins util_vector_logic_1/Res] [get_bd_pins util_reduced_logic_1/Op1]
connect_bd_net [get_bd_pins triggers_0/counter_mask] [get_bd_pins util_vector_logic_2/Op2]
connect_bd_net [get_bd_pins util_vector_logic_2/Res] [get_bd_pins util_reduced_logic_2/Op1]
connect_bd_net -net prescaleSignal_0_output [get_bd_pins prescaleSignal_0/prescale_output] [get_bd_pins util_vector_logic_3/Op1]
connect_bd_net [get_bd_pins util_vector_logic_3/Res] [get_bd_ports speaker]
connect_bd_net [get_bd_pins triggers_0/speaker_scale] [get_bd_pins prescaleSignal_0/rate]
connect_bd_net [get_bd_pins util_vector_logic_4/Res] [get_bd_pins util_reduced_logic_3/Op1]
connect_bd_net [get_bd_pins util_reduced_logic_3/Res] [get_bd_ports tellie_delay_out]
connect_bd_net [get_bd_pins triggers_0/trigger_async_mask] [get_bd_pins util_vector_logic_4/Op2]
connect_bd_net [get_bd_pins prescaleTrigger_0/prescale_mask] [get_bd_pins util_vector_logic_5/Op2]
connect_bd_net [get_bd_pins util_vector_logic_5/Res] [get_bd_pins util_reduced_logic_4/Op1]
connect_bd_net [get_bd_pins prescaleTrigger_0/prescale_rate] [get_bd_pins prescaleSignal_1/rate]
connect_bd_net -net prescaleSignal_1_output [get_bd_pins prescaleSignal_1/prescale_output] [get_bd_pins util_vector_logic_6/Op2]
connect_bd_net [get_bd_pins util_reduced_logic_4/Res] [get_bd_pins util_vector_logic_6/Op1] [get_bd_pins prescaleSignal_1/prescale_input]
connect_bd_net [get_bd_pins burstTrigger_0/burst_master_mask] [get_bd_pins util_vector_logic_7/Op2]
connect_bd_net [get_bd_pins util_vector_logic_7/Res] [get_bd_pins util_reduced_logic_5/Op1] [get_bd_pins util_vector_logic_8/Op1]
connect_bd_net [get_bd_pins util_reduced_logic_5/Res] [get_bd_pins burstTrigger_0/burst_trigin]
connect_bd_net [get_bd_pins burstTrigger_0/burst_slave_mask] [get_bd_pins util_vector_logic_8/Op2]
connect_bd_net [get_bd_pins util_vector_logic_8/Res] [get_bd_pins util_reduced_logic_6/Op1]
connect_bd_net [get_bd_pins util_reduced_logic_6/Res] [get_bd_pins util_vector_logic_9/Op2]
connect_bd_net [get_bd_pins util_vector_logic_9/Res] [get_bd_pins xlconcat_0/In2]
connect_bd_net [get_bd_pins testPulser_0/pulser_out] [get_bd_pins xlconcat_0/In5]
connect_bd_net [get_bd_pins trigwordfifo_0/wr_enable] [get_bd_pins fifo_generator_1/wr_en]
connect_bd_net [get_bd_pins trigwordfifo_0/rd_enable] [get_bd_pins fifo_generator_1/rd_en]
connect_bd_net [get_bd_pins trigwordfifo_0/reset] [get_bd_pins fifo_generator_1/rst]
connect_bd_net [get_bd_pins util_vector_logic_12/Res] [get_bd_pins util_vector_logic_11/Op2]
connect_bd_net [get_bd_pins util_vector_logic_10/Res] [get_bd_pins util_vector_logic_13/Op1]
connect_bd_net [get_bd_pins util_vector_logic_11/Res] [get_bd_pins util_vector_logic_13/Op2]
connect_bd_net [get_bd_pins util_vector_logic_13/Res] [get_bd_pins tellieDelay/pulse_in]
connect_bd_net [get_bd_pins ellie_control_0/tellie_control] [get_bd_pins util_vector_logic_10/Op2] [get_bd_pins util_vector_logic_12/Op1]
connect_bd_net [get_bd_pins fifo_generator_1/dout] [get_bd_pins trigwordfifo_0/wordin]
connect_bd_net [get_bd_pins trigwordfifo_0/wordout] [get_bd_pins triggers_0/trigs_in]
connect_bd_net [get_bd_pins anticoincTrigger_0/anticoinc_trigout] [get_bd_pins xlconcat_0/In8]
connect_bd_net [get_bd_pins coincTrigger_0/coinc_trigout] [get_bd_pins xlconcat_0/In9]
connect_bd_net [get_bd_pins register_mux_0/mux_out] [get_bd_ports generic_delay_out]
connect_bd_net [get_bd_pins register_mux_1/mux_out] [get_bd_pins genericDelay/pulse_in] [get_bd_pins register_mux_0/mux_in1]

# ---- address map ----
assign_bd_address -offset 0x43C00000 -range 4K -target_address_space [get_bd_addr_spaces processing_system7_0/Data] [get_bd_addr_segs prescaleSignal_0/S00_AXI/S00_AXI_reg]
assign_bd_address -offset 0x43C01000 -range 4K -target_address_space [get_bd_addr_spaces processing_system7_0/Data] [get_bd_addr_segs prescaleTrigger_0/S00_AXI/S00_AXI_reg]
assign_bd_address -offset 0x43C02000 -range 4K -target_address_space [get_bd_addr_spaces processing_system7_0/Data] [get_bd_addr_segs fifo_readout_0/S00_AXI/S00_AXI_reg]
assign_bd_address -offset 0x43C03000 -range 4K -target_address_space [get_bd_addr_spaces processing_system7_0/Data] [get_bd_addr_segs clockLogic_0/S00_AXI/S00_AXI_reg]
assign_bd_address -offset 0x43C04000 -range 4K -target_address_space [get_bd_addr_spaces processing_system7_0/Data] [get_bd_addr_segs comboTrigger_0/S00_AXI/S00_AXI_reg]
assign_bd_address -offset 0x43C05000 -range 4K -target_address_space [get_bd_addr_spaces processing_system7_0/Data] [get_bd_addr_segs countDisplay_0/S00_AXI/S00_AXI_reg]
assign_bd_address -offset 0x43C06000 -range 4K -target_address_space [get_bd_addr_spaces processing_system7_0/Data] [get_bd_addr_segs ShiftRegisters_0/S00_AXI/S00_AXI_reg]
assign_bd_address -offset 0x43C07000 -range 4K -target_address_space [get_bd_addr_spaces processing_system7_0/Data] [get_bd_addr_segs genericPulser/S00_AXI/S00_AXI_reg]
assign_bd_address -offset 0x43C08000 -range 4K -target_address_space [get_bd_addr_spaces processing_system7_0/Data] [get_bd_addr_segs smelliePulser/S00_AXI/S00_AXI_reg]
assign_bd_address -offset 0x43C09000 -range 4K -target_address_space [get_bd_addr_spaces processing_system7_0/Data] [get_bd_addr_segs triggers_0/S00_AXI/S00_AXI_reg]
assign_bd_address -offset 0x43C0A000 -range 4K -target_address_space [get_bd_addr_spaces processing_system7_0/Data] [get_bd_addr_segs oneshot_pulse_0/S00_AXI/S00_AXI_reg]
assign_bd_address -offset 0x43C0B000 -range 4K -target_address_space [get_bd_addr_spaces processing_system7_0/Data] [get_bd_addr_segs genericDelay/S00_AXI/S00_AXI_reg]
assign_bd_address -offset 0x43C0C000 -range 4K -target_address_space [get_bd_addr_spaces processing_system7_0/Data] [get_bd_addr_segs gtDelay/S00_AXI/S00_AXI_reg]
assign_bd_address -offset 0x43C0D000 -range 4K -target_address_space [get_bd_addr_spaces processing_system7_0/Data] [get_bd_addr_segs smellieDelay/S00_AXI/S00_AXI_reg]
assign_bd_address -offset 0x43C0E000 -range 4K -target_address_space [get_bd_addr_spaces processing_system7_0/Data] [get_bd_addr_segs tellieDelay/S00_AXI/S00_AXI_reg]
assign_bd_address -offset 0x43C0F000 -range 4K -target_address_space [get_bd_addr_spaces processing_system7_0/Data] [get_bd_addr_segs oneshot_pulse_1/S00_AXI/S00_AXI_reg]
assign_bd_address -offset 0x43C10000 -range 4K -target_address_space [get_bd_addr_spaces processing_system7_0/Data] [get_bd_addr_segs MZ_Happy/S00_AXI/S00_AXI_reg]
assign_bd_address -offset 0x43C11000 -range 4K -target_address_space [get_bd_addr_spaces processing_system7_0/Data] [get_bd_addr_segs telliePulser/S00_AXI/S00_AXI_reg]
assign_bd_address -offset 0x43C12000 -range 4K -target_address_space [get_bd_addr_spaces processing_system7_0/Data] [get_bd_addr_segs burstTrigger_0/S00_AXI/S00_AXI_reg]
assign_bd_address -offset 0x43C13000 -range 4K -target_address_space [get_bd_addr_spaces processing_system7_0/Data] [get_bd_addr_segs trigwordfifo_0/S00_AXI/S00_AXI_reg]
assign_bd_address -offset 0x43C14000 -range 4K -target_address_space [get_bd_addr_spaces processing_system7_0/Data] [get_bd_addr_segs prescaleSignal_1/S00_AXI/S00_AXI_reg]
assign_bd_address -offset 0x43C15000 -range 4K -target_address_space [get_bd_addr_spaces processing_system7_0/Data] [get_bd_addr_segs implement_gtid_0/S00_AXI/S00_AXI_reg]
assign_bd_address -offset 0x43C16000 -range 4K -target_address_space [get_bd_addr_spaces processing_system7_0/Data] [get_bd_addr_segs testPulser_0/S00_AXI/S00_AXI_reg]
assign_bd_address -offset 0x43C17000 -range 4K -target_address_space [get_bd_addr_spaces processing_system7_0/Data] [get_bd_addr_segs ellie_control_0/S00_AXI/S00_AXI_reg]
assign_bd_address -offset 0x43C18000 -range 4K -target_address_space [get_bd_addr_spaces processing_system7_0/Data] [get_bd_addr_segs anticoincTrigger_0/S00_AXI/S00_AXI_reg]
assign_bd_address -offset 0x43C19000 -range 4K -target_address_space [get_bd_addr_spaces processing_system7_0/Data] [get_bd_addr_segs coincTrigger_0/S00_AXI/S00_AXI_reg]
assign_bd_address -offset 0x43C20000 -range 4K -target_address_space [get_bd_addr_spaces processing_system7_0/Data] [get_bd_addr_segs register_mux_0/S00_AXI/S00_AXI_reg]
assign_bd_address -offset 0x43C21000 -range 4K -target_address_space [get_bd_addr_spaces processing_system7_0/Data] [get_bd_addr_segs clockCounter_0/S00_AXI/S00_AXI_reg]
assign_bd_address -offset 0x43C22000 -range 4K -target_address_space [get_bd_addr_spaces processing_system7_0/Data] [get_bd_addr_segs clockCounter_1/S00_AXI/S00_AXI_reg]
assign_bd_address -offset 0x43C23000 -range 4K -target_address_space [get_bd_addr_spaces processing_system7_0/Data] [get_bd_addr_segs clockComparison_0/S00_AXI/S00_AXI_reg]
assign_bd_address -offset 0x43C24000 -range 4K -target_address_space [get_bd_addr_spaces processing_system7_0/Data] [get_bd_addr_segs register_mux_1/S00_AXI/S00_AXI_reg]

validate_bd_design
save_bd_design
